# Altium project PCB_Project_1.PrjPcb
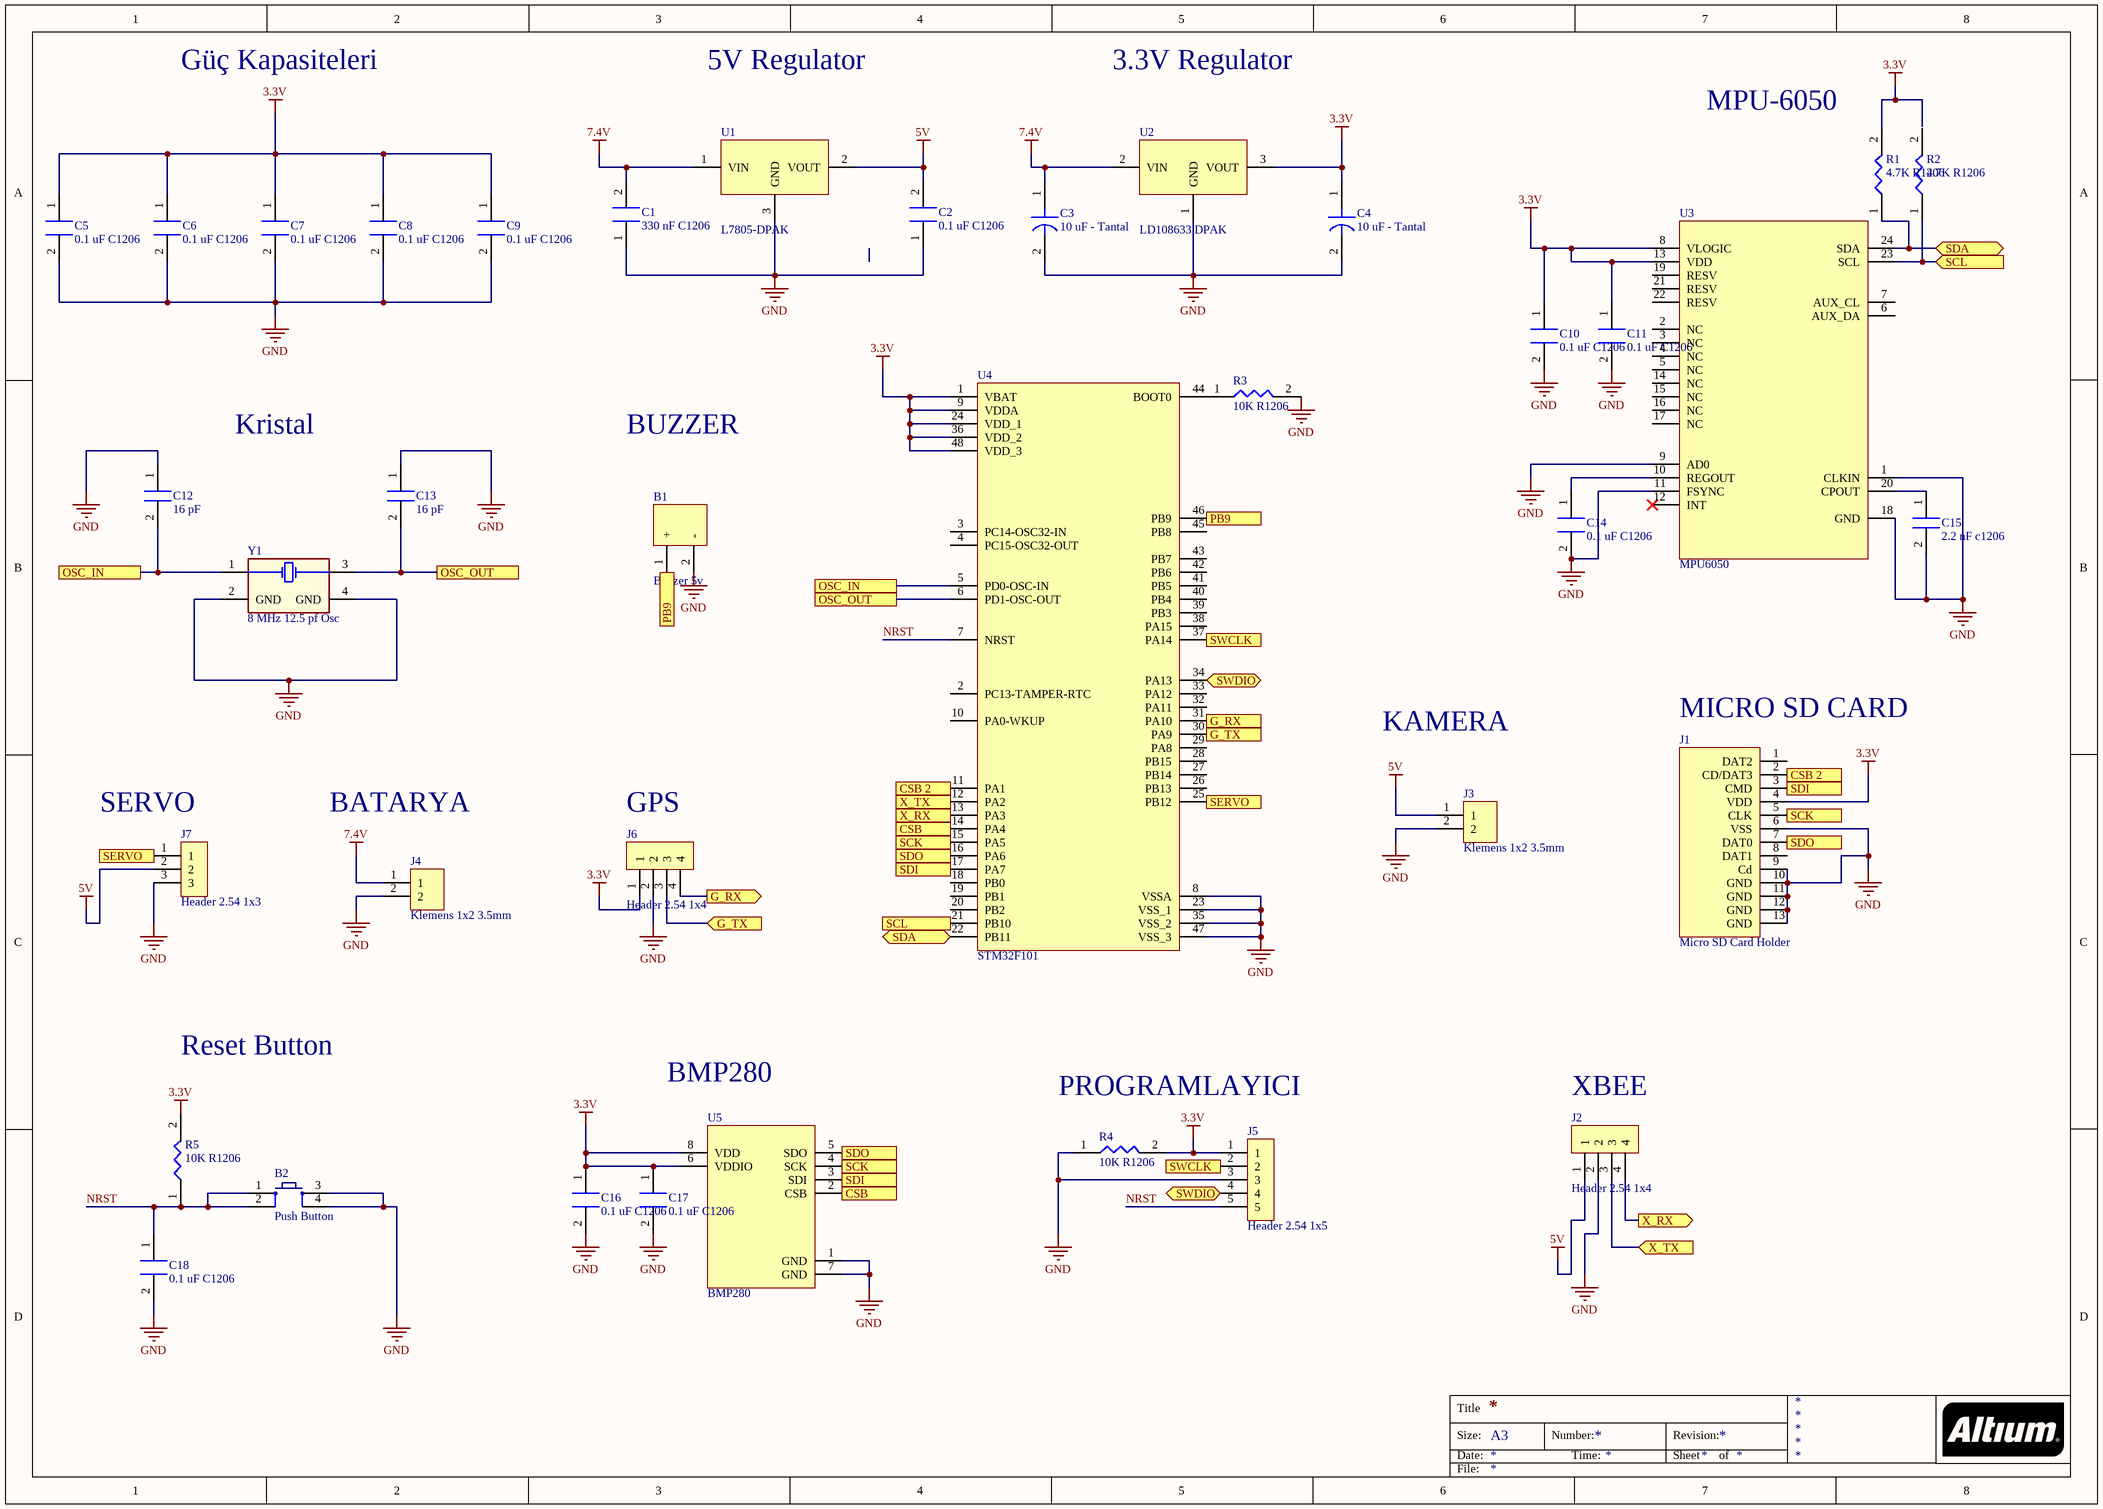
[diagram p0: stm32.SchDoc]
1 sheet, 38 parts. Net scope: flat (ports and power ports of the same name join across sheets).
Board file: stm32.PcbDoc

## Sheet stm32.SchDoc
size A3

### Parts
B1  Buzzer 5v  [BUZZER 5V]
B2  Push Button  [PUSB BUTTON-SMD]
C1  330 nF C1206  [C1206]
C2  0.1 uF C1206  [C1206]
C3  10 uF - Tantal  [C1206 - TANTAL]
C4  10 uF - Tantal  [C1206 - TANTAL]
C5  0.1 uF C1206  [C1206]
C6  0.1 uF C1206  [C1206]
C7  0.1 uF C1206  [C1206]
C8  0.1 uF C1206  [C1206]
C9  0.1 uF C1206  [C1206]
C10  0.1 uF C1206  [C1206]
C11  0.1 uF C1206  [C1206]
C12  16 pF  [C1206]
C13  16 pF  [C1206]
C14  0.1 uF C1206  [C1206]
C15  2.2 nF c1206  [C1206]
C16  0.1 uF C1206  [C1206]
C17  0.1 uF C1206  [C1206]
C18  0.1 uF C1206  [C1206]
J1  Micro SD Card Holder  [MICRO SD CARD HOLDER]
J2  Header 2.54 1x4  [Header 2.54 1x4]
J3  Klemens 1x2 3.5mm  [Klemens 1x2 3.5mm]
J4  Klemens 1x2 3.5mm  [Klemens 1x2 3.5mm]
J5  Header 2.54 1x5  [Header 2.54 1x5]
J6  Header 2.54 1x4  [Header 2.54 1x4]
J7  Header 2.54 1x3  [Header 2.54 1x3]
R1  4.7K R1206  [R1206 RESISTOR]
R2  4.7K R1206  [R1206 RESISTOR]
R3  10K R1206  [R1206 RESISTOR]
R4  10K R1206  [R1206 RESISTOR]
R5  10K R1206  [R1206 RESISTOR]
U1  L7805-DPAK  [DPAK228P972X230-3N]
U2  LD108633 DPAK  [DPAK228P972X230-3N]
U3  MPU6050  [QFN50P400X400X90_HS-25N]
U4  STM32F101  [LQFP48-STM]
U5  BMP280  [BMP280]
Y1  8 MHz 12.5 pf Osc  [8 MHZ Osc.]

### Ports
CSB 2 (in), CSB 2 (out), CSB (in), CSB (out), G_RX (in), G_RX (out), G_TX (in), G_TX (out), OSC_IN, OSC_OUT, PB9 (in), PB9 (out), SCK (in), SCK (out), SCL (in), SCL (out), SDA (bidir), SDI (in), SDI (out), SDO (in), SDO (out), SERVO (in), SERVO (out), SWCLK (in), SWCLK (out), SWDIO (bidir), X_RX (in), X_RX (out), X_TX (in), X_TX (out)

### Nets
3.3V: C4.1 C5.1 C6.1 C7.1 C8.1 C9.1 C10.1 C11.1 C16.1 C17.1 J1.4(VDD) J5.1 J6.1 R1.2 R4.2 R5.2 U2.3(VOUT) U3.8(VLOGIC) U3.13(VDD) U4.1(VBAT) U4.9(VDDA) U4.24(VDD_1) U4.36(VDD_2) U4.48(VDD_3) U5.6(VDDIO) U5.8(VDD)
5V: C2.2 J2.1 J3.1 J7.2 U1.2(VOUT)
7.4V: C1.2 C3.1 J4.1 U1.1(VIN) U2.2(VIN)
GND: B1.2(-) B2.3 B2.4 C1.1 C2.1 C3.2 C4.2 C5.2 C6.2 C7.2 C8.2 C9.2 C10.2 C11.2 C12.1 C13.1 C14.2 C15.2 C16.2 C17.2 C18.2 J1.6(VSS) J1.9(Cd) J1.10(GND) J1.11(GND) J1.12(GND) J1.13(GND) J2.2 J3.2 J4.2 J5.3 J6.2 J7.3 R3.2 R4.1 U1.3(GND) U2.1(GND) U3.1(CLKIN) U3.9(AD0) U3.11(FSYNC) U3.18(GND) U4.8(VSSA) U4.23(VSS_1) U4.35(VSS_2) U4.47(VSS_3) U5.1(GND) U5.7(GND) Y1.2(GND) Y1.4(GND)
NRST: B2.1 B2.2 C18.1 J5.5 R5.1 U4.7(NRST)
NetB1_1: B1.1(+) U4.46(PB9) ; port PB9
NetC12_2: C12.2 U4.5(PD0-OSC-IN) Y1.1 ; port OSC_IN
NetC13_2: C13.2 U4.6(PD1-OSC-OUT) Y1.3 ; port OSC_OUT
NetC14_1: C14.1 U3.10(REGOUT)
NetC15_1: C15.1 U3.20(CPOUT)
NetJ1_2: J1.2(CD/DAT3) U4.11(PA1) ; port CSB 2
NetJ1_3: J1.3(CMD) U4.17(PA7) U5.3(SDI) ; port SDI
NetJ1_5: J1.5(CLK) U4.15(PA5) U5.4(SCK) ; port SCK
NetJ1_7: J1.7(DAT0) U4.16(PA6) U5.5(SDO) ; port SDO
NetJ2_3: J2.3 U4.12(PA2) ; port X_TX
NetJ2_4: J2.4 U4.13(PA3) ; port X_RX
NetJ5_2: J5.2 U4.37(PA14) ; port SWCLK
NetJ5_4: J5.4 U4.34(PA13) ; port SWDIO
NetJ6_3: J6.3 U4.30(PA9) ; port G_TX
NetJ6_4: J6.4 U4.31(PA10) ; port G_RX
NetJ7_1: J7.1 U4.25(PB12) ; port SERVO
NetR1_1: R1.1 U3.24(SDA) U4.22(PB11) ; port SDA
NetR2_1: R2.1 U3.23(SCL) U4.21(PB10) ; port SCL
NetR3_1: R3.1 U4.44(BOOT0)
NetU4_14: U4.14(PA4) U5.2(CSB) ; port CSB

Not connected (* = marked no-connect by the designer): J1 1(DAT2) 8(DAT1); R2 2; U3 2(NC) 3(NC) 4(NC) 5(NC) 6(AUX_DA) 7(AUX_CL) 12(INT)* 14(NC) 15(NC) 16(NC) 17(NC) 19(RESV) 21(RESV) 22(RESV); U4 2(PC13-TAMPER-RTC) 3(PC14-OSC32-IN) 4(PC15-OSC32-OUT) 10(PA0-WKUP) 18(PB0) 19(PB1) 20(PB2) 26(PB13) 27(PB14) 28(PB15) 29(PA8) 32(PA11) 33(PA12) 38(PA15) 39(PB3) 40(PB4) 41(PB5) 42(PB6) 43(PB7) 45(PB8)

### Notes on the sheet
- Güç Kapasiteleri
- 5V Regulator
- 3.3V Regulator
- MPU-6050
- Kristal
- BUZZER
- KAMERA
- (near J1) MICRO SD CARD
- (near J7) SERVO
- BATARYA
- (near J6) GPS
- Reset Button
- BMP280
- PROGRAMLAYICI
- (near J2) XBEE
- Title
- Size:
- Date:
- A3
- Number:
- Time:
- Revision:
- Sheet
- of
- File:

### Library data of the parts
B1 = Buzzer 5v: BUZZER MAGNETIC 5V 12MM TH; Manufacturer: CUI Devices; Part Number: 102-1124-ND; Operating Temperature: -30°C ~ 70°C; Price: $1.87
B2 = Push Button: Smd Push Button; Satın Alma Linki: https://urun.n11.com/diger/mini-pushbutton-switch-smd-P227461537?gclid=Cj0KCQjwkoDmBRCcARIsAG3xzl8Y_-jeD7HocNM6lvuZ_rVp83568XPGtNzlPwXWLph8oCRqo0yh87UaApZYEALw_wcB&gclsrc=aw.ds
C1 = 330 nF C1206: CAP CER 0.33UF 50V X7R 1206; Manufacturer: KEMET; Part Number: 399-C1206C334K5RAC7800TR-ND; Value: 330 nF; Operating Temperature: -55°C ~ 125°C; Price: $0.66
C2 C5-C11 C14 C16-C18 = 0.1 uF C1206: CAP CER 0.1UF 50V X7R 1206; Manufacturer: KEMET; Part Number: 399-C1206C104K5RAC7800TR-ND; Operating Temperature: -55°C ~ 125°C; Price: $0.10; Value: 0.1 uF
C3 C4 = 10 uF - Tantal: CAP.TANTAL 10UF 20V 20% A CASE (3216); Manufacturer: KEMET; Part Number: 399-5152-2-ND; Operating Temperature: -55°C~+125°C; Price: $0.35; Value: 10 uF
C12 C13 = 16 pF: CAP CER 16PF 50V NP0 1206; Manufacturer: KEMET; Part Number: 399-17465-2-ND; Operating Temperature: -55°C ~ 125°C; Price: $0.41; Value: 16 pF
C15 = 2.2 nF c1206: CAP CER 2200PF 50V C0G/NP0 1206; Manufacturer: KEMET; Part Number: 399-C1206C222G5GAC7800TR-ND; Value: 2.2 nF; Operating Temperature: -55°C ~ 125°C; Price: $1.06
J1 = Micro SD Card Holder: CONNECTOR MICRO SD CARD SMD KLS; Manufacturer: KLS ELECTRONIC; Part Number: KLS1-TF-003; Operating Temperature: -25°C~+90°C; Price: $0.30
J5 = Header 2.54 1x5: FEMALE HEADER 5PIN(1x5) 2.54mm THT V/T TRAY; Manufacturer: KLS ELECTRONIC; Part Number: KLS1-208-1-05-S; Operating Temperature: -45°C~+105°C; Price: $0.04
R1 R2 = 4.7K R1206: CPF 1206 4R64 0.1% 25PPM 1K RL; Manufacturer: TE Connectivity Passive Product; Part Number: 1712-CPF1206B4R64E1TR-ND - Tape & Reel (TR); Operating Temperature: -55°C ~ 155°C; Price: $0.78; Value: 4.7K
R3-R5 = 10K R1206: RQ 0805 10R 0.1% 10PPM 1K RL; Manufacturer: TE Connectivity Passive Product; Part Number: 1712-RQ73C2A10RBTDFTR-ND - Tape & Reel (TR); Operating Temperature: -55°C ~ 155°C; Price: $1.14; Value: 10K
U1 = L7805-DPAK: IC REG LINEAR 5V 1.5A DPAK; Manufacturer: STMicroelectronics; Part Number: 497-7255-2-ND; Operating Temperature: 0°C ~ 125°C; Price: $1.20
U2 = LD108633 DPAK: IC REG LINEAR 3.3V 1.5A DPAK; Manufacturer: STMicroelectronics; Part Number: 497-3446-2-ND; Operating Temperature: -40°C~+125°C; Price: $1.59
U3 = MPU6050: IMU ACCEL/GYRO 3-AXIS I2C 24QFN; Manufacturer: TDK InvenSense; Part Number: 1428-1007-2-ND; Operating Temperature: -40°C ~ 85°C (TA); Price: $9.11
U4 = STM32F101: IC MCU 32BIT 64KB FLASH 48LQFP; Manufacturer: STMicroelectronics; Part Number: 497-6063-ND; Operating Temperature: -40°C ~ 85°C (TA); Price: $7.64
U5 = BMP280: SENSOR PRESSURE ABS; Manufacturer: Bosch Sensortec; Part Number: 828-1064-2-ND; Operating Temperature: -40°C ~ 85°C; Price: $3.74
Y1 = 8 MHz 12.5 pf Osc: CRYSTAL 8MHZ 12.5pF SMD TR RALTRON; Part Number: RH100-8.000-12.5-20150-E; Manufacturer: RALTRON; Operating Temperature: -40°C~+85°C; Price: $0.56